# Altium schematic sheet 1_P1.schdoc
size 431 x 309 mm; Symbol: Sheet-Symbol_A3; Device: Sheet-Symbol_A3; @Page Name: P1; @Create Date: 2023-01-31; @Page Count: 1; @Page No: 1; @Project Name: 辉光管学习设计; @Schematic Name: Schematic1; @Update Date: 2023-02-01; Company: 嘉立创EDA; Page Size: A3; Version: V1.0
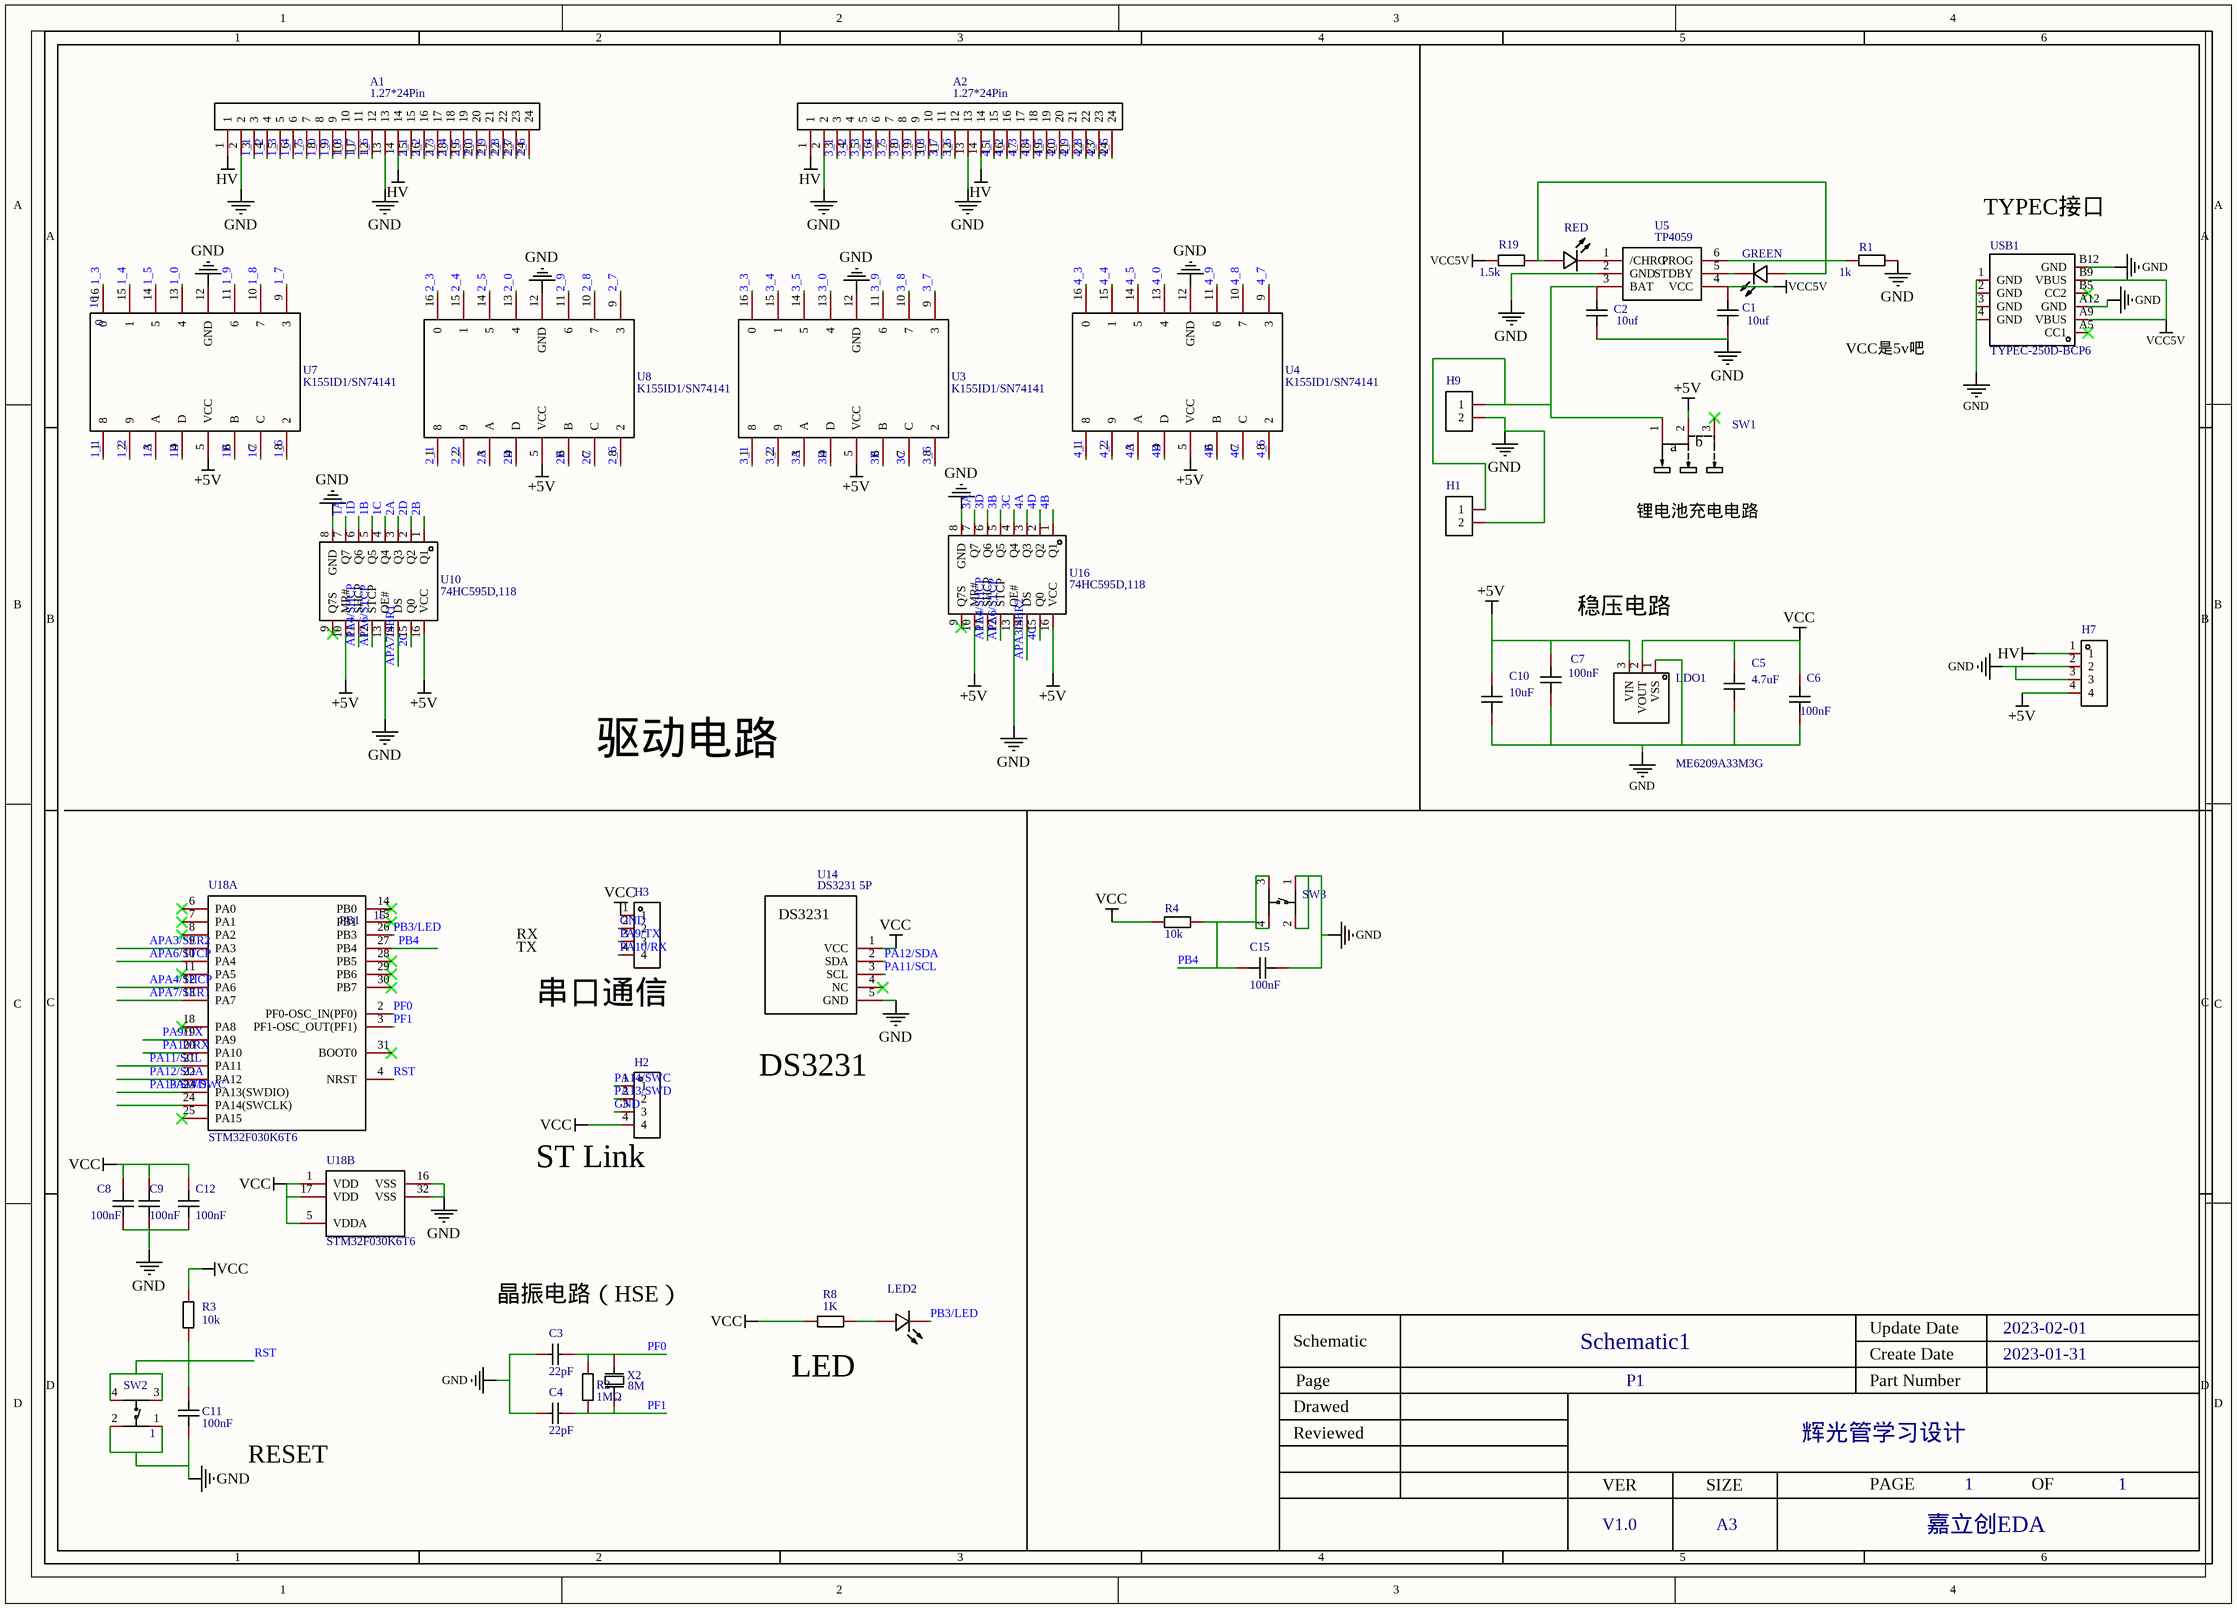
[diagram p0: 1_P1.schdoc]

## Parts
A1  1.27*24Pin  [1.27*24PIN_MYSELF]
A2  1.27*24Pin  [1.27*24PIN_MYSELF]
C1  value 10uf  [C0805]  (hidden comment: 0805B106K100NT)
C2  value 10uf  [C0805]  (hidden comment: 0805B106K100NT)
C3  value 22pF  [C0805]  (hidden comment: CC0805JRNPO9BN220)
C4  value 22pF  [C0805]  (hidden comment: CC0805JRNPO9BN220)
C5  value 4.7uF  [C0805]  (hidden comment: CC0805KKX5R8BB475)
C6  value 100nF  [C0805]  (hidden comment: TCC0805X7R104K250DTS)
C7  value 100nF  [C0805]  (hidden comment: TCC0805X7R104K250DTS)
C8  value 100nF  [C0805]  (hidden comment: GRM033C81E104KE14D)
C9  value 100nF  [C0805]  (hidden comment: GRM033C81E104KE14D)
C10  value 10uF  [C0805]  (hidden comment: CL21B106KOQNNNE)
C11  100nF  [C0805]
C12  value 100nF  [C0805]  (hidden comment: GRM033C81E104KE14D)
C15  value 100nF  [C0805]  (hidden comment: GRM033C81E104KE14D)
GREEN  NCD0805G1  [LED0805-R-RD]  (value not drawn)
H1  HDR-F_2.54_1x2P  [HDR-TH_2P-P2.54-V-F]  (value not drawn)
H2  HDR-F_2.54_1x4P  [HDR-TH_4P-P2.54-V-F]  (value not drawn)
H3  HDR-F_2.54_1x4P  [HDR-TH_4P-P2.54-V-F]  (value not drawn)
H7  HDR-F_2.54_1x4P  [HDR-TH_4P-P2.54-V-F]  (value not drawn)
H9  HDR-F_2.54_1x2P  [HDR-TH_2P-P2.54-V-F]  (value not drawn)
LDO1  ME6209A33M3G  [SOT-23-3_L2.9-W1.6-P1.90-LS2.8-BR]
LED2  D21121300350-LED0805  [LED0805-R-RD]  (value not drawn)
R1  value 1k  [R0805]  (hidden comment: RC0805FR-0724KL)
R2  1MΩ  [R0805]
R3  value 10k  [R0805]  (hidden comment: RC0805FR-0724KL)
R4  value 10k  [R0805]  (hidden comment: AR05DTCW1002)
R8  1K  [R0805]
R19  value 1.5k  [R0805]  (hidden comment: RC0805FR-0724KL)
RED  NCD0805G1  [LED0805-R-RD]  (value not drawn)
SW1  K3-1260D-K1  [SW-TH_K3-1260D-K1]  (value not drawn)
SW2  NUMBER: 1  [SW-TH_4P-L6.0-W6.0-P4.50-LS6.5]  (hidden comment: TC-6610F-5-260G)
SW3  TC-6610F-5-260G  [SW-TH_4P-L6.0-W6.0-P4.50-LS6.5]  (value not drawn)
U3  K155ID1/SN74141  [DIP16]
U4  K155ID1/SN74141  [DIP16]
U5  TP4059  [SOT-23-6_L2.9-W1.6-P0.95-LS2.8-BR]
U7  NAME: 0  NUMBER: 16  [DIP16]  (hidden comment: K155ID1/SN74141)
U8  K155ID1/SN74141  [DIP16]
U10  74HC595D,118  [SOIC-16_L9.9-W3.9-P1.27-LS6.0-BL]
U14  DS3231 5P  [DS3231]
U16  74HC595D,118  [SOIC-16_L9.9-W3.9-P1.27-LS6.0-BL]
U18  NAME: PB1  NUMBER: 15  [TQFP-32_L7.0-W7.0-P0.50-BL]  (hidden comment: STM32F030K6T6)  (parts A,B of 2)
USB1  TYPEC-250D-BCP6  [USB-C-SMD_TYPEC-250D-BCP6]
X2  8M  [HC-49US_L11.0-W4.6-P4.88]

## Nets
+5V: C7.2 C10.2 H7.4 LDO1.3(VIN) SW1.2 U3.5(VCC) U4.5(VCC) U7.5(VCC) U8.5(VCC) U10.10(MR#) U10.16(VCC) U16.10(MR#) U16.16(VCC)
GND: A1.2 A1.13 A2.2 A2.13 C1.2 C2.2 C3.1 C4.1 C5.1 C6.1 C7.1 C8.2 C9.2 C10.1 C11.1 C12.2 C15.2 H1.2 H2.3 H3.2 H7.2 H7.3 H9.2 LDO1.1(VSS) R1.2 SW2.1(A) SW2.2(B) SW3.1(A) SW3.2(B) U3.12(GND) U4.12(GND) U5.2(GND) U7.12(GND) U8.12(GND) U10.8(GND) U10.13(OE#) U14.5(GND) U16.8(GND) U16.13(OE#) U18.16(VSS) U18.32(VSS) USB1.1(GND) USB1.2(GND) USB1.3(GND) USB1.4(GND) USB1.A12(GND) USB1.B12(GND)
HV: A1.1 A1.14 A2.1 A2.14 H7.1
VCC: C5.2 C6.2 C8.1 C9.1 C12.1 H2.4 H3.1 LDO1.2(VOUT) R3.2 R4.1 R8.2 U14.1(VCC) U18.1(VDD) U18.5(VDDA) U18.17(VDD)
VCC5V: C1.1 R19.1 U5.4(VCC) USB1.A9(VBUS) USB1.B9(VBUS)
1_0: A1.8 U7.13(4)
1_1: A1.3 U7.1(8)
1_2: A1.4 U7.2(9)
1_3: A1.5 U7.16(0)
1_4: A1.6 U7.15(1)
1_5: A1.7 U7.14(5)
1_6: A1.12 U7.8(2)
1_7: A1.11 U7.9(3)
1_8: A1.10 U7.10(7)
1_9: A1.9 U7.11(6)
1A: U7.3(A) U10.7(Q7)
1B: U7.6(B) U10.5(Q5)
1C: U7.7(C) U10.4(Q4)
1D: U7.4(D) U10.6(Q6)
2_0: A1.20 U8.13(4)
2_1: A1.15 U8.1(8)
2_2: A1.16 U8.2(9)
2_3: A1.17 U8.16(0)
2_4: A1.18 U8.15(1)
2_5: A1.19 U8.14(5)
2_6: A1.24 U8.8(2)
2_7: A1.23 U8.9(3)
2_8: A1.22 U8.10(7)
2_9: A1.21 U8.11(6)
2A: U8.3(A) U10.3(Q3)
2B: U8.6(B) U10.1(Q1)
2C: U8.7(C) U10.15(Q0)
2D: U8.4(D) U10.2(Q2)
3_0: A2.8 U3.13(4)
3_1: A2.3 U3.1(8)
3_2: A2.4 U3.2(9)
3_3: A2.5 U3.16(0)
3_4: A2.6 U3.15(1)
3_5: A2.7 U3.14(5)
3_6: A2.12 U3.8(2)
3_7: A2.11 U3.9(3)
3_8: A2.10 U3.10(7)
3_9: A2.9 U3.11(6)
3A: U3.3(A) U16.7(Q7)
3B: U3.6(B) U16.5(Q5)
3C: U3.7(C) U16.4(Q4)
3D: U3.4(D) U16.6(Q6)
4_0: A2.20 U4.13(4)
4_1: A2.15 U4.1(8)
4_2: A2.16 U4.2(9)
4_3: A2.17 U4.16(0)
4_4: A2.18 U4.15(1)
4_5: A2.19 U4.14(5)
4_6: A2.24 U4.8(2)
4_7: A2.23 U4.9(3)
4_8: A2.22 U4.10(7)
4_9: A2.21 U4.11(6)
4A: U4.3(A) U16.3(Q3)
4B: U4.6(B) U16.1(Q1)
4C: U4.7(C) U16.15(Q0)
4D: U4.4(D) U16.2(Q2)
APA3/SER2: U16.14(DS) U18.9(PA3)
APA4/SHCP: U10.11(SHCP) U16.11(SHCP) U18.12(PA6)
APA6/STCP: U10.12(STCP) U16.12(STCP) U18.10(PA4)
APA7/SER1: U10.14(DS) U18.13(PA7)
PA9/TX: H3.3 U18.19(PA9)
PA10/RX: H3.4 U18.20(PA10)
PA11/SCL: U14.3(SCL) U18.21(PA11)
PA12/SDA: U14.2(SDA) U18.22(PA12)
PA13/SWD: H2.1 H2.2 U18.23(PA13(SWDIO))  [also labelled PA14/SWC]
PB3/LED: LED2.2(-) U18.26(PB3)
PB4: C15.1 R4.2 SW3.3(C) SW3.4(D) U18.27(PB4)
PF0: C3.2 R2.2 U18.2(PF0-OSC_IN(PF0)) X2.2(OSC2)
PF1: C4.2 R2.1 U18.3(PF1-OSC_OUT(PF1)) X2.1(OSC1)
RST: C11.2 R3.1 SW2.3(C) SW2.4(D) U18.4(NRST)
NetC2_1: C2.1 H1.1 H9.1 SW1.1 U5.3(BAT)
NetGREEN_1: GREEN.1(A) R19.2 RED.1(A)
NetGREEN_2: GREEN.2(K) U5.5(STDBY)
NetLED2_1: LED2.1(+) R8.1
NetR1_1: R1.1 U5.6(PROG)
NetRED_2: RED.2(K) U5.1(/CHRG)

Not connected (* = marked no-connect by the designer): SW1 3*; U10 9(Q7S)*; U14 4(NC)*; U16 9(Q7S)*; U18 6(PA0)* 7(PA1)* 8(PA2)* 11(PA5)* 14(PB0)* 15(PB1)* 18(PA8)* 24(PA14(SWCLK)) 25(PA15)* 28(PB5)* 29(PB6)* 30(PB7)* 31(BOOT0)*; USB1 A5(CC1)* B5(CC2)*

## Notes on the sheet
- (near USB1) TYPEC接口
- VCC是5v吧
- 锂电池充电电路
- 稳压电路
- 驱动电路
- TX
- RX
- (near H3) 串口通信
- (near U14) DS3231
- (near H2) ST Link
- 晶振电路（HSE）
- (near R8) LED
- RESET
- 1
- 2
- 3
- 4
- 5
- 6
- A
- B
- C
- Schematic
- Schematic1
- Create Date
- Update Date
- 2023-01-31
- 2023-02-01
- D
- Reviewed
- Drawed
- Page
- P1
- Part Number
- 辉光管学习设计
- VER
- SIZE
- PAGE
- OF
- V1.0
- A3
- 嘉立创EDA
- (in symbol K3-1260D-K1) b; a

## Library data of the parts
A1 A2 = 1.27*24Pin: Add into BOM: yes; Name: 1.27*24Pin; Symbol: 1.27*24Pin; Device: 1.27*24Pin; Convert to PCB: yes; Origin Footprint: 1.27*24PIN_MYSELF
C1 C2 = 0805B106K100NT: 容值:10uF;精度:±10%;额定电压:10V;温度系数:X7R;; Manufacturer: FH(风华); Add into BOM: yes; Tolerance: ±10%; Voltage Rated: 10V; Temperature Coefficient: X7R; Symbol: 0805B106K100NT; Device: 0805B106K100NT; LCSC Part Name: 10uF ±10% 10V; Supplier Part: C90544; Manufacturer Part: 0805B106K100NT; Supplier Footprint: 0805; JLCPCB Part Class: Extended Part; Datasheet: https://atta.szlcsc.com/upload/public/pdf/source/20170923/C90544_1506149563055988970.pdf; Supplier: LCSC; Convert to PCB: yes
C3 C4 = CC0805JRNPO9BN220: 容值:22pF;精度:±5%;额定电压:50V;温度系数:NP0;; Manufacturer: YAGEO(国巨); Add into BOM: yes; Tolerance: ±5%; Voltage Rated: 50V; Temperature Coefficient: NP0; Symbol: CC0805JRNPO9BN220; Device: CC0805JRNPO9BN220; LCSC Part Name: 22pF ±5% 50V; Supplier Part: C105623; Manufacturer Part: CC0805JRNPO9BN220; Supplier Footprint: 0805; JLCPCB Part Class: Extended Part; Datasheet: https://atta.szlcsc.com/upload/public/pdf/source/20170425/1493115772948.pdf; Supplier: LCSC; Convert to PCB: yes
C5 = CC0805KKX5R8BB475: 容值:4.7uF;精度:±10%;额定电压:25V;温度系数:X5R;; Manufacturer: YAGEO(国巨); Add into BOM: yes; Tolerance: ±10%; Voltage Rated: 25V; Temperature Coefficient: X5R; Symbol: CC0805KKX5R8BB475; Device: CC0805KKX5R8BB475; LCSC Part Name: 4.7uF ±10% 25V; Supplier Part: C132173; Manufacturer Part: CC0805KKX5R8BB475; Supplier Footprint: 0805; JLCPCB Part Class: Extended Part; Datasheet: https://atta.szlcsc.com/upload/public/pdf/source/20180820/C132173_6FEE718E05F4F70062189A38690F3008.pdf; Supplier: LCSC; Convert to PCB: yes
C6 C7 = TCC0805X7R104K250DTS: 容值:100nF;精度:±10%;额定电压:25V;温度系数:X7R;; Manufacturer: CCTC(三环); Add into BOM: yes; Tolerance: ±10%; Voltage Rated: 25V; Temperature Coefficient: X7R; Symbol: TCC0805X7R104K250DTS; Device: TCC0805X7R104K250DTS; LCSC Part Name: 100nF ±10% 25V; Supplier Part: C376923; Manufacturer Part: TCC0805X7R104K250DTS; Supplier Footprint: 0805; JLCPCB Part Class: Extended Part; Datasheet: https://atta.szlcsc.com/upload/public/pdf/source/20190418/C376923_132AE681988A7150F2DFEA56798C5038.pdf; Supplier: LCSC; Convert to PCB: yes
C8 C9 C12 C15 = GRM033C81E104KE14D: 容值:100nF;精度:±10%;额定电压:25V;温度系数:X6S;; Manufacturer: muRata(村田); Add into BOM: yes; Tolerance: ±10%; Voltage Rated: 25V; Temperature Coefficient: X6S; Symbol: GRM033C81E104KE14D; Device: GRM033C81E104KE14D; LCSC Part Name: 100nF ±10% 25V; Supplier Part: C181047; Manufacturer Part: GRM033C81E104KE14D; Supplier Footprint: 0201; JLCPCB Part Class: Extended Part; Datasheet: https://atta.szlcsc.com/upload/public/pdf/source/20190505/C181047_36981D841DC23B79CCB6797818D1B5CF.pdf; Supplier: LCSC; Convert to PCB: yes
C10 = CL21B106KOQNNNE: 容值:10uF;精度:±10%;额定电压:16V;温度系数:X7R;; Manufacturer: SAMSUNG(三星); Add into BOM: yes; Tolerance: ±10%; Voltage Rated: 16V; Temperature Coefficient: X7R; Symbol: CL21B106KOQNNNE; Device: CL21B106KOQNNNE; LCSC Part Name: 10uF ±10% 16V; Supplier Part: C95841; Manufacturer Part: CL21B106KOQNNNE; Supplier Footprint: 0805; JLCPCB Part Class: Extended Part; Datasheet: https://atta.szlcsc.com/upload/public/pdf/source/20170228/1488267683307.pdf; Supplier: LCSC; Convert to PCB: yes
C11 = 100nF: Manufacturer: 火炬; Manufacturer Part: C0805B104M500NT; 3DModel: C0805_L2.0-W1.3-H1.3; Add into BOM: yes; NUMBER: 2; Name: 100nF; Symbol: 100nF; Device: 100nF; link: https://item.szlcsc.com/373011.html; Supplier: LCSC; Supplier Part: C515949; JLCPCB Part Class: Extended Part; Convert to PCB: yes; Origin Footprint: C0805
GREEN RED = NCD0805G1: 发光颜色:翠绿;; Manufacturer: 国星光电; Symbol: FC-2012UGK-520D5; Add into BOM: yes; Emitted Color: 翠绿; Device: NCD0805G1; LCSC Part Name: 翠绿; Supplier Part: C84260; Manufacturer Part: NCD0805G1; Supplier Footprint: 0805; JLCPCB Part Class: Extended Part; Datasheet: https://atta.szlcsc.com/upload/public/pdf/source/20200820/C84260_AFC7BF57C6FBA034D182BB8D10A67EFE.pdf; Supplier: LCSC; Convert to PCB: yes
H1 H9 = HDR-F_2.54_1x2P: Symbol: Header-Female-2.54_1x2; Convert to PCB: yes; Device: HDR-F_2.54_1x2P; Add into BOM: yes; Supplier Part: C49661; Supplier Footprint: 插件
H2 H3 H7 = HDR-F_2.54_1x4P: Symbol: 2.54-1*4P母; Convert to PCB: yes; Device: HDR-F_2.54_1x4P; Add into BOM: yes; Supplier Part: C2718488; Supplier Footprint: 插件
LDO1 = ME6209A33M3G: 输出类型:固定;输出极性:正;输出通道数:1;最大输入电压:18V;输出电压:3.3V;压差:80mV@(40mA);输出电流:250mA;电源纹波抑制比(PRSS):-;; Manufacturer: MICRONE(南京微盟); Add into BOM: yes; Output Type: 固定; Output Polarity: 正; Number of Outputs: 1; Maximum Input Voltage: 18V; Output Voltage: 3.3V; Output Current: 250mA; Name: ME6209A33M3G; Symbol: ME6209A33M3G; Device: ME6209A33M3G; LCSC Part Name: Vin=18V Vout=3.3V 250mA; Supplier Part: C83508; Manufacturer Part: ME6209A33M3G; Supplier Footprint: SOT-23-3L; JLCPCB Part Class: Extended Part; Datasheet: https://atta.szlcsc.com/upload/public/pdf/source/20161212/1481539101152.pdf; Supplier: LCSC; Convert to PCB: yes; Dropout Voltage: 80mV@(40mA); Power Supply Rejection Ratio (PRSS): -
LED2 = D21121300350-LED0805: Manufacturer: null; 3DModel: LED0805_Green; Add into BOM: yes; Name: D21121300350-LED0805; Symbol: D21121300350-LED0805; Device: D21121300350-LED0805; link: https://item.szlcsc.com/88042.html; Supplier: LCSC; Supplier Part: C9900003974; Manufacturer Part: D21121300350-LED0805; JLCPCB Part Class: Extended Part; Convert to PCB: yes; Origin Footprint: LED0805-R-RD
R1 R3 R19 = RC0805FR-0724KL: 阻值:24k;精度:±1%;功率:125mW;温度系数:±100ppm/;最大工作电压:150V;工作温度范围:-55~+155;; Manufacturer: YAGEO(国巨); Add into BOM: yes; Tolerance: ±1%; Power(Watts): 125mW; Overload Voltage (Max): 150V; Symbol: RC0805FR-0724KL; Device: RC0805FR-0724KL; LCSC Part Name: 24k ±1%; Supplier Part: C137562; Manufacturer Part: RC0805FR-0724KL; Supplier Footprint: 0805; JLCPCB Part Class: Extended Part; Datasheet: https://atta.szlcsc.com/upload/public/pdf/source/20171106/C137562_15099605184181093713.pdf; Supplier: LCSC; Convert to PCB: yes; Temperature Coefficient: ±100ppm/; Operating Temperature Range: -55~+155
R2 = 1MΩ: Manufacturer: ResistorToday; Manufacturer Part: AECR0805F1M00K9; 3DModel: R0805_L2.0-W1.3-H0.6; Resistance: 1M; Add into BOM: yes; Name: 1MΩ; Symbol: 1MΩ; Device: 1MΩ; link: https://item.szlcsc.com/142685.html; Supplier: LCSC; Supplier Part: C328386; Convert to PCB: yes; Origin Footprint: R0805
R4 = AR05DTCW1002: 电阻类型:薄膜电阻;阻值:10k;精度:±0.5%;功率:125mW;温度系数:±25ppm/;最大工作电压:100V;工作温度范围:-55~+155;; Manufacturer: 光颉(Viking); Add into BOM: yes; Tolerance: ±0.5%; Power(Watts): 125mW; Temperature Coefficient: ±25ppm/; Overload Voltage (Max): 100V; Symbol: AR05DTCW1002; Device: AR05DTCW1002; LCSC Part Name: 10k ±0.5% 125mW; Supplier Part: C319941; Manufacturer Part: AR05DTCW1002; Supplier Footprint: 0805; JLCPCB Part Class: Extended Part; Datasheet: https://atta.szlcsc.com/upload/public/pdf/source/20181220/C319941_05776DBB286B9ED5294631979742F42B.pdf; Supplier: LCSC; Convert to PCB: yes; Type: 薄膜电阻; Operating Temperature Range: -55~+155
R8 = 1K: Manufacturer: ResistorToday; Manufacturer Part: AECR0805F150KK9; 3DModel: R0805_L2.0-W1.3-H0.6; Add into BOM: yes; Name: 1K; Symbol: 1K; Device: 1K; link: https://item.szlcsc.com/142685.html; Supplier: LCSC; Supplier Part: C328382; Convert to PCB: yes; Origin Footprint: R0805
SW1 = K3-1260D-K1: 额定电流(DC):300mA;额定电压(DC):6V;额定电流(AC):-;额定电压(AC):-;电路结构:单刀双掷;安装方式:卧插;机械寿命:10000;开关颜色:黑色;滑钮形状:矩形柱状;引脚样式:PC引脚;工作温度:-25℃~+80℃;开关长度:9mm;开关宽度:3.5mm;开关高度:3.5mm;; Manufacturer: 韩国韩荣; Add into BOM: yes; Current Rating (DC): 300mA; Voltage Rating (DC): 6V; Circuit: 单刀双掷; Mechanical Life: 10000; Actuator Color: 黑色; Actuator Style: 矩形柱状; Pin Style: PC引脚; Switch Length: 9mm; Switch Width: 3.5mm; Name: K3-1260D-K1; Symbol: K3-1260D-K1; Device: K3-1260D-K1; LCSC Part Name: K3-1260D-K1; Supplier Part: C223844; Manufacturer Part: K3-1260D-K1; Supplier Footprint: 插件; JLCPCB Part Class: Extended Part; Datasheet: https://atta.szlcsc.com/upload/public/pdf/source/20210810/7351E43B93A35FB9B10B4EA1B1334DD2.pdf; Supplier: LCSC; Convert to PCB: yes; Current Rating (AC): -; Voltage Rating (AC): -; Mounting Style: 卧插; Operating Temperature: -25℃~+80℃; Switch Height: 3.5mm
SW2 SW3 = TC-6610F-5-260G: 触点电流:50mA;额定电压(DC):12V;绝缘电阻:100M;电路结构:单刀单掷;安装方式:直插;按钮形状:圆形按钮;按钮/盖帽颜色:黑色;带灯:无;作用力:260gf@±50gf;机械寿命:80000;工作温度:-25~+85;引脚样式:PC引脚;开关高度:5mm;; Manufacturer: HCTL(华灿天禄); Add into BOM: yes; Contact Current: 50mA; Voltage Rating (DC): 12V; Insulation Resistance: 100M; Circuit: 单刀单掷; Actuator Style: 圆形按钮; Actuator/Cap Color: 黑色; With Lamp: 无; Mechanical Life: 80000; Pin Style: PC引脚; Switch Height: 5mm; Symbol: TC-6610F-5-260G; Device: TC-6610F-5-260G; LCSC Part Name: TC-6610F-5-260G; Supplier Part: C2845299; Manufacturer Part: TC-6610F-5-260G; Supplier Footprint: 插件; JLCPCB Part Class: Extended Part; Datasheet: https://atta.szlcsc.com/upload/public/pdf/source/20210806/C2845299_348B4218FCFDC93121AB683A180987F2.pdf; Supplier: LCSC; Convert to PCB: yes; Mounting Style: 直插; Operating Force: 260gf@±50gf; Operating Temperature: -25~+85
U3 U4 U8 = K155ID1/SN74141: Add into BOM: yes; Name: K155ID1/SN74141; Symbol: K155ID1/SN74141; Device: K155ID1/SN74141; Convert to PCB: yes; Origin Footprint: DIP16
U5 = TP4059: Manufacturer: TOPPOWER; Convert to PCB: yes; Name: TP4059; Symbol: TP4059; Device: TP4059; Supplier: LCSC; Manufacturer Part: TP4059; Supplier Part: C80364; JLCPCB Part Class: Extended Part; Add into BOM: yes; Origin Footprint: SOT-23-6_L2.9-W1.6-P0.95-LS2.8-BR
U7 = K155ID1/SN74141: Add into BOM: yes; Pin Type: IN; Name: K155ID1/SN74141; Symbol: K155ID1/SN74141; Device: K155ID1/SN74141; Convert to PCB: yes; Origin Footprint: DIP16
U10 U16 = 74HC595D,118: Manufacturer: Nexperia; 3DModel: SOIC-16_L9.9-W3.9-H1.8-LS6.0-P1.27; Add into BOM: yes; Name: 74HC595D,118; Symbol: 74HC595D,118; Device: 74HC595D,118; link: http://datasheet.octopart.com/MC14076BDR2G-ON-Semiconductor-datasheet-608107.pdf; Supplier: LCSC; Manufacturer Part: 74HC595D,118; Supplier Part: C5947; JLCPCB Part Class: Basic Part; Convert to PCB: yes; Origin Footprint: SOIC-16_L9.9-W3.9-P1.27-LS6.0-BL
U14 = DS3231 5P: Add into BOM: yes; Name: DS3231 5P; Symbol: DS3231 5P; Device: DS3231 5P; link: Small Formfactor For Raspberry PI; Manufacturer Part: DS3231; Convert to PCB: yes; Origin Footprint: DS3231
U18 = STM32F030K6T6: CPU内核:ARM Cortex-M0;CPU最大主频:48MHz;工作电压范围:2.4V~3.6V;内部振荡器:有;程序 FLASH容量:32K@x8bit;RAM总容量:4KB;EEPROM/数据 FLASH容量:-;GPIO端口数量:26;ADC(单元数/通道数/位数):1@x12ch/12bit;外设/功能/协议栈:DMA；看门狗；PWM;工作温度范围:-40℃~+85℃;; Manufacturer: ST(意法半导体); Add into BOM: yes; Maximum Frequency: 48MHz; Internal Oscillator: 有; RAM Size: 4KB; GPIO Ports Number: 26; Name: STM32F030K6T6; Symbol: STM32F030K6T6; Device: STM32F030K6T6; LCSC Part Name: ARM Cortex-M0 48MHz 闪存：32K@x8bit RAM：4KB; Supplier Part: C46830; Manufacturer Part: STM32F030K6T6; Supplier Footprint: TQFP-32(7x7); JLCPCB Part Class: Extended Part; Datasheet: https://atta.szlcsc.com/upload/public/pdf/source/20150427/1457707279009.pdf; Supplier: LCSC; Convert to PCB: yes; CPU Core: ARM Cortex-M0; Supply Voltage Range: 2.4V~3.6V; Program FLASH Size: 32K@x8bit; EEPROM/Data FLASH Size: -; ADC (Units/Channels/bits): 1@x12ch/12bit; Peripherals / Functions / Protocol Stacks: DMA；看门狗；PWM; Operating Temperature Range: -40℃~+85℃
USB1 = TYPEC-250D-BCP6: 连接器类型:Type-C;标准:USB 3.1;公母:母座;触点数量:6;端口数量:1;安装方式:卧贴;额定电流 - 电源:3A;工作温度范围:-25~+85;焊接温度(最大值):260;; Manufacturer: XUNPU(讯普); Add into BOM: yes; Connector Type: Type-C; Gender: 母座; Number of Contacts: 6; Number of Ports: 1; Current Rating - Power (Max): 3A; Welding Temperature (Max): 260; Name: TYPEC-250D-BCP6; Symbol: TYPEC-250D-BCP6; Device: TYPEC-250D-BCP6; LCSC Part Name: Type-C 母座 卧贴; Supplier Part: C720626; Manufacturer Part: TYPEC-250D-BCP6; Supplier Footprint: SMD; JLCPCB Part Class: Extended Part; Datasheet: https://atta.szlcsc.com/upload/public/pdf/source/20200812/C720626_0B3D9525FB9C6D818696E28704B18234.pdf; Supplier: LCSC; Convert to PCB: yes; Standard: USB 3.1; Mounting Style: 卧贴; Operating Temperature Range: -25~+85
X2 = 49SAC08000182060: 晶振类型:49S晶振;工作温度:-;; Manufacturer: JGHC(晶光华); Add into BOM: yes; Crystal Type: 49S晶振; Name: 8M; Symbol: 49SAC08000182060; Device: 49SAC08000182060; LCSC Part Name: HC-49S 8MHZ 18PF 20PPM; Supplier Part: C390747; Manufacturer Part: 49SAC08000182060; Supplier Footprint: HC-49S; JLCPCB Part Class: Extended Part; Datasheet: https://atta.szlcsc.com/upload/public/pdf/source/20191012/C390747_81316E4F70B570C645DE19ECCB729A4F.pdf; Supplier: LCSC; Convert to PCB: yes; Operating Temperature: -